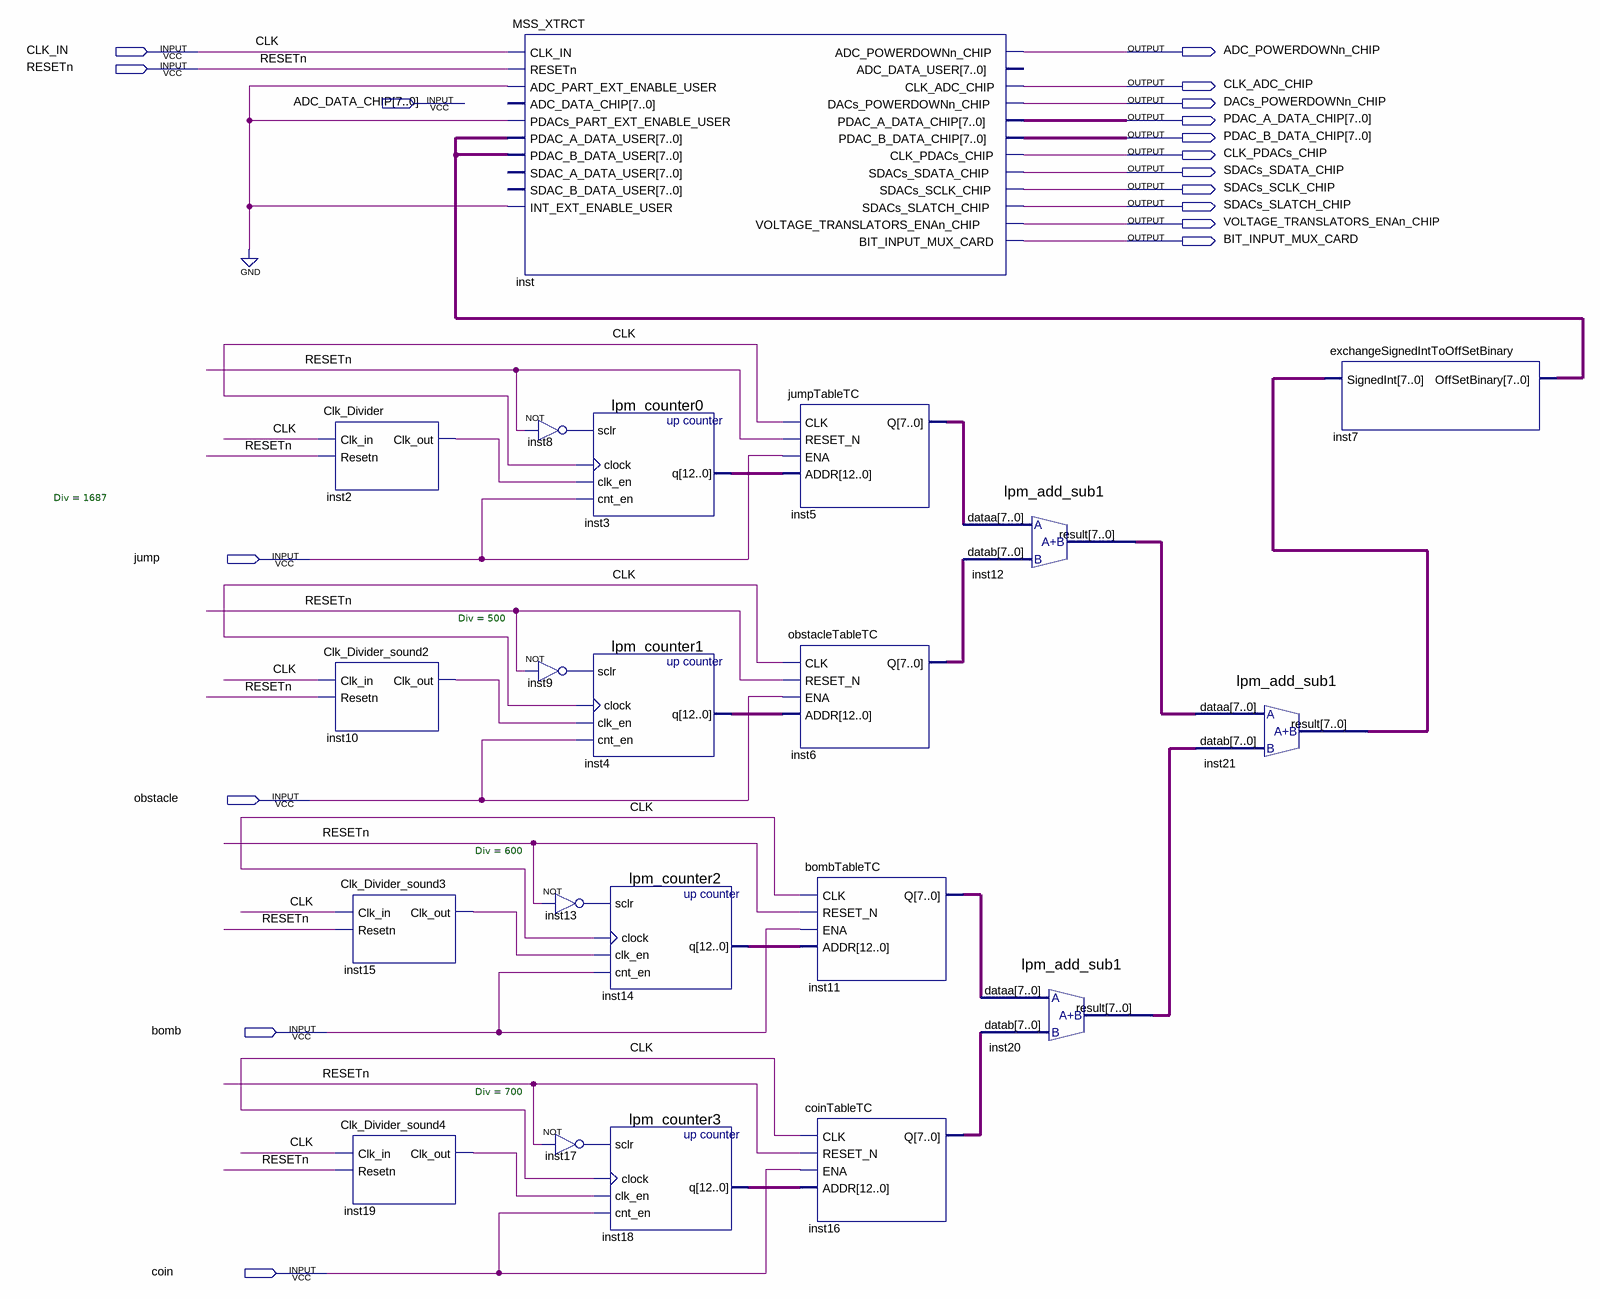
[diagram p0: schematic sheet]
// Quartus schematic Signal_gen.bdf as structural Verilog: 21 symbols, 18 pins
module Signal_gen (
  input  CLK_IN,
  input  RESETn,
  input  [7:0] ADC_DATA_CHIP,
  input  jump,
  input  obstacle,
  input  bomb,
  input  coin,
  output ADC_POWERDOWNn_CHIP,
  output CLK_ADC_CHIP,
  output DACs_POWERDOWNn_CHIP,
  output [7:0] PDAC_A_DATA_CHIP,
  output [7:0] PDAC_B_DATA_CHIP,
  output CLK_PDACs_CHIP,
  output SDACs_SDATA_CHIP,
  output SDACs_SCLK_CHIP,
  output SDACs_SLATCH_CHIP,
  output VOLTAGE_TRANSLATORS_ENAn_CHIP,
  output BIT_INPUT_MUX_CARD
);

  wire inst2_clk_out, inst8_out, inst9_out, inst10_clk_out, inst13_out, inst15_clk_out, inst17_out,
       inst19_clk_out;
  wire [7:0] inst5_q, inst6_q, inst7_offsetbinary, inst11_q, inst12_result, inst16_q, inst20_result,
       inst21_result;
  wire [12:0] inst3_q, inst4_q, inst14_q, inst18_q;

  Clk_Divider #(.Div(1687)) inst2 (.Clk_in(CLK_IN), .Resetn(RESETn), .Clk_out(inst2_clk_out));
  Clk_Divider_sound2 #(.Div(500)) inst10 (.Clk_in(CLK_IN), .Resetn(RESETn), .Clk_out(inst10_clk_out));
  Clk_Divider_sound3 #(.Div(600)) inst15 (.Clk_in(CLK_IN), .Resetn(RESETn), .Clk_out(inst15_clk_out));
  Clk_Divider_sound4 #(.Div(700)) inst19 (.Clk_in(CLK_IN), .Resetn(RESETn), .Clk_out(inst19_clk_out));
  MSS_XTRCT inst (
    .CLK_IN(CLK_IN), .RESETn(RESETn), .ADC_PART_EXT_ENABLE_USER(1'b0), .PDACs_PART_EXT_ENABLE_USER(1'b0),
    .PDAC_A_DATA_USER(inst7_offsetbinary), .PDAC_B_DATA_USER(inst7_offsetbinary), .INT_EXT_ENABLE_USER(1'b0),
    .ADC_POWERDOWNn_CHIP(ADC_POWERDOWNn_CHIP), .CLK_ADC_CHIP(CLK_ADC_CHIP),
    .DACs_POWERDOWNn_CHIP(DACs_POWERDOWNn_CHIP), .PDAC_A_DATA_CHIP(PDAC_A_DATA_CHIP),
    .PDAC_B_DATA_CHIP(PDAC_B_DATA_CHIP), .CLK_PDACs_CHIP(CLK_PDACs_CHIP),
    .SDACs_SDATA_CHIP(SDACs_SDATA_CHIP), .SDACs_SCLK_CHIP(SDACs_SCLK_CHIP),
    .SDACs_SLATCH_CHIP(SDACs_SLATCH_CHIP), .VOLTAGE_TRANSLATORS_ENAn_CHIP(VOLTAGE_TRANSLATORS_ENAn_CHIP),
    .BIT_INPUT_MUX_CARD(BIT_INPUT_MUX_CARD));  // open: ADC_DATA_CHIP, SDAC_A_DATA_USER, SDAC_B_DATA_USER, ADC_DATA_USER
  lpm_counter0 inst3 (.sclr(inst8_out), .clock(CLK_IN), .clk_en(inst2_clk_out), .cnt_en(jump), .q(inst3_q));
  not inst8 (inst8_out, RESETn);
  lpm_counter1 inst4 (.sclr(inst9_out), .clock(CLK_IN), .clk_en(inst10_clk_out), .cnt_en(obstacle), .q(inst4_q));
  not inst9 (inst9_out, RESETn);
  not inst13 (inst13_out, RESETn);
  not inst17 (inst17_out, RESETn);
  lpm_counter2 inst14 (.sclr(inst13_out), .clock(CLK_IN), .clk_en(inst15_clk_out), .cnt_en(bomb), .q(inst14_q));
  lpm_counter3 inst18 (.sclr(inst17_out), .clock(CLK_IN), .clk_en(inst19_clk_out), .cnt_en(coin), .q(inst18_q));
  jumpTableTC inst5 (.CLK(CLK_IN), .RESET_N(RESETn), .ENA(jump), .ADDR(inst3_q), .Q(inst5_q));
  obstacleTableTC inst6 (.CLK(CLK_IN), .RESET_N(RESETn), .ENA(obstacle), .ADDR(inst4_q), .Q(inst6_q));
  bombTableTC inst11 (.CLK(CLK_IN), .RESET_N(RESETn), .ENA(bomb), .ADDR(inst14_q), .Q(inst11_q));
  coinTableTC inst16 (.CLK(CLK_IN), .RESET_N(RESETn), .ENA(coin), .ADDR(inst18_q), .Q(inst16_q));
  lpm_add_sub1 inst12 (.dataa(inst5_q), .datab(inst6_q), .result(inst12_result));
  lpm_add_sub1 inst20 (.dataa(inst11_q), .datab(inst16_q), .result(inst20_result));
  lpm_add_sub1 inst21 (.dataa(inst12_result), .datab(inst20_result), .result(inst21_result));
  exchangeSignedIntToOffSetBinary inst7 (.SignedInt(inst21_result), .OffSetBinary(inst7_offsetbinary));

  // Other names for the same wires on the sheet: CLK = CLK_IN
endmodule
